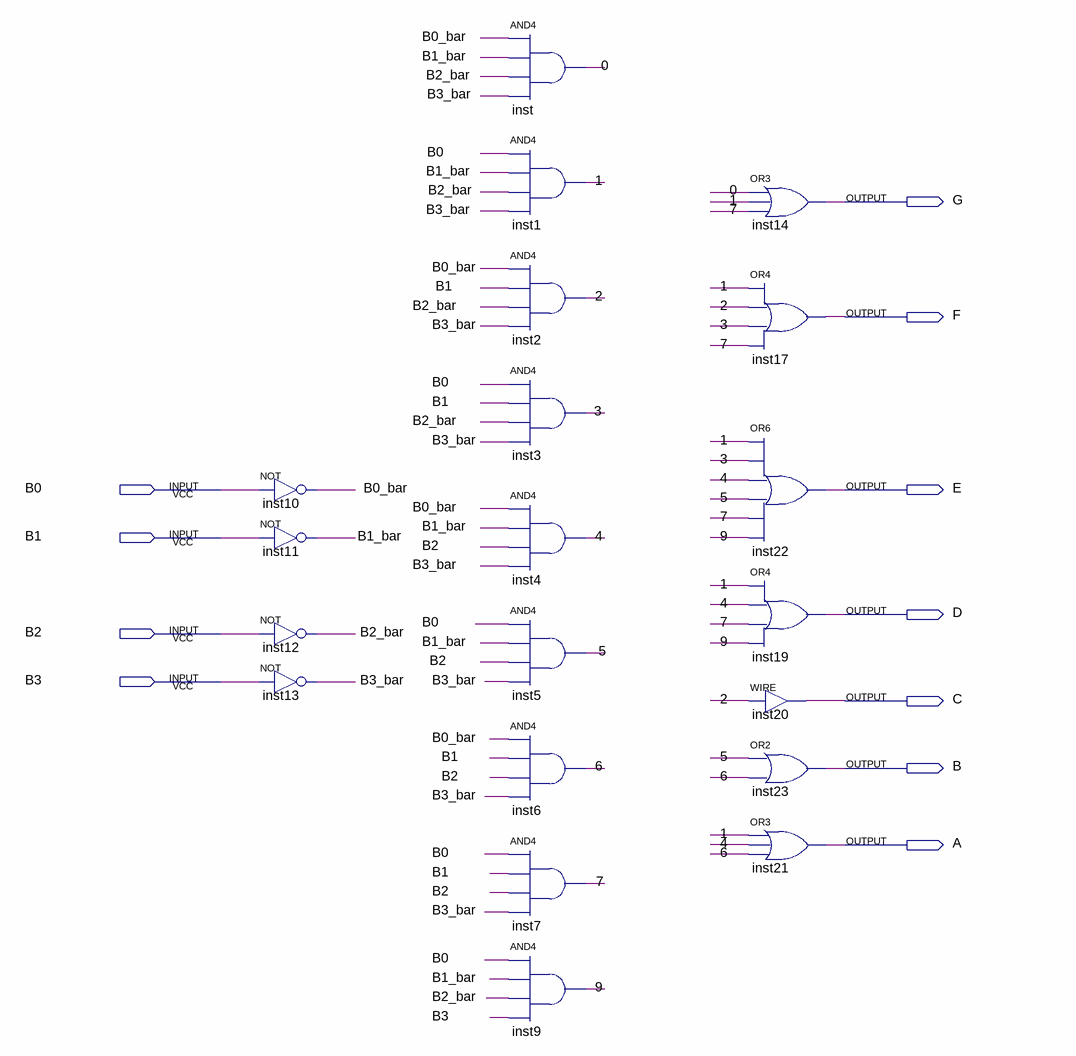
[diagram p0: schematic sheet]
// Quartus schematic BCD_seven_seg_A.bdf as structural Verilog: 20 symbols, 11 pins
module BCD_seven_seg_A (
  input  B0,
  input  B1,
  input  B2,
  input  B3,
  output G,
  output F,
  output E,
  output D,
  output C,
  output B,
  output A
);

  wire \0 , \1 , \2 , \3 , \4 , \5 , \6 , \7 , \9 , B0_bar, B1_bar, B2_bar, B3_bar;

  not inst10 (B0_bar, B0);
  not inst11 (B1_bar, B1);
  not inst12 (B2_bar, B2);
  not inst13 (B3_bar, B3);
  and inst (\0 , B0_bar, B1_bar, B2_bar, B3_bar);
  and inst1 (\1 , B0, B1_bar, B2_bar, B3_bar);
  and inst2 (\2 , B0_bar, B1, B2_bar, B3_bar);
  and inst3 (\3 , B0, B1, B2_bar, B3_bar);
  and inst4 (\4 , B0_bar, B1_bar, B2, B3_bar);
  and inst5 (\5 , B0, B1_bar, B2, B3_bar);
  and inst6 (\6 , B0_bar, B1, B2, B3_bar);
  and inst7 (\7 , B0, B1, B2, B3_bar);
  and inst9 (\9 , B0, B1_bar, B2_bar, B3);
  or inst14 (G, \0 , \1 , \7 );
  or inst17 (F, \1 , \2 , \3 , \7 );
  or inst22 (E, \1 , \3 , \4 , \5 , \7 , \9 );
  or inst19 (D, \1 , \4 , \7 , \9 );
  assign C = \2 ;  // WIRE inst20
  or inst23 (B, \5 , \6 );
  or inst21 (A, \1 , \4 , \6 );
endmodule
